# EasyEDA schematic Geiger Counter II_2021-02-28.json
TITLE: Geiger Counter; REV: 1.0; Date: 2021-01-13; Sheet: 1/1; Drawn By: Lawrence Link; Company: LPD
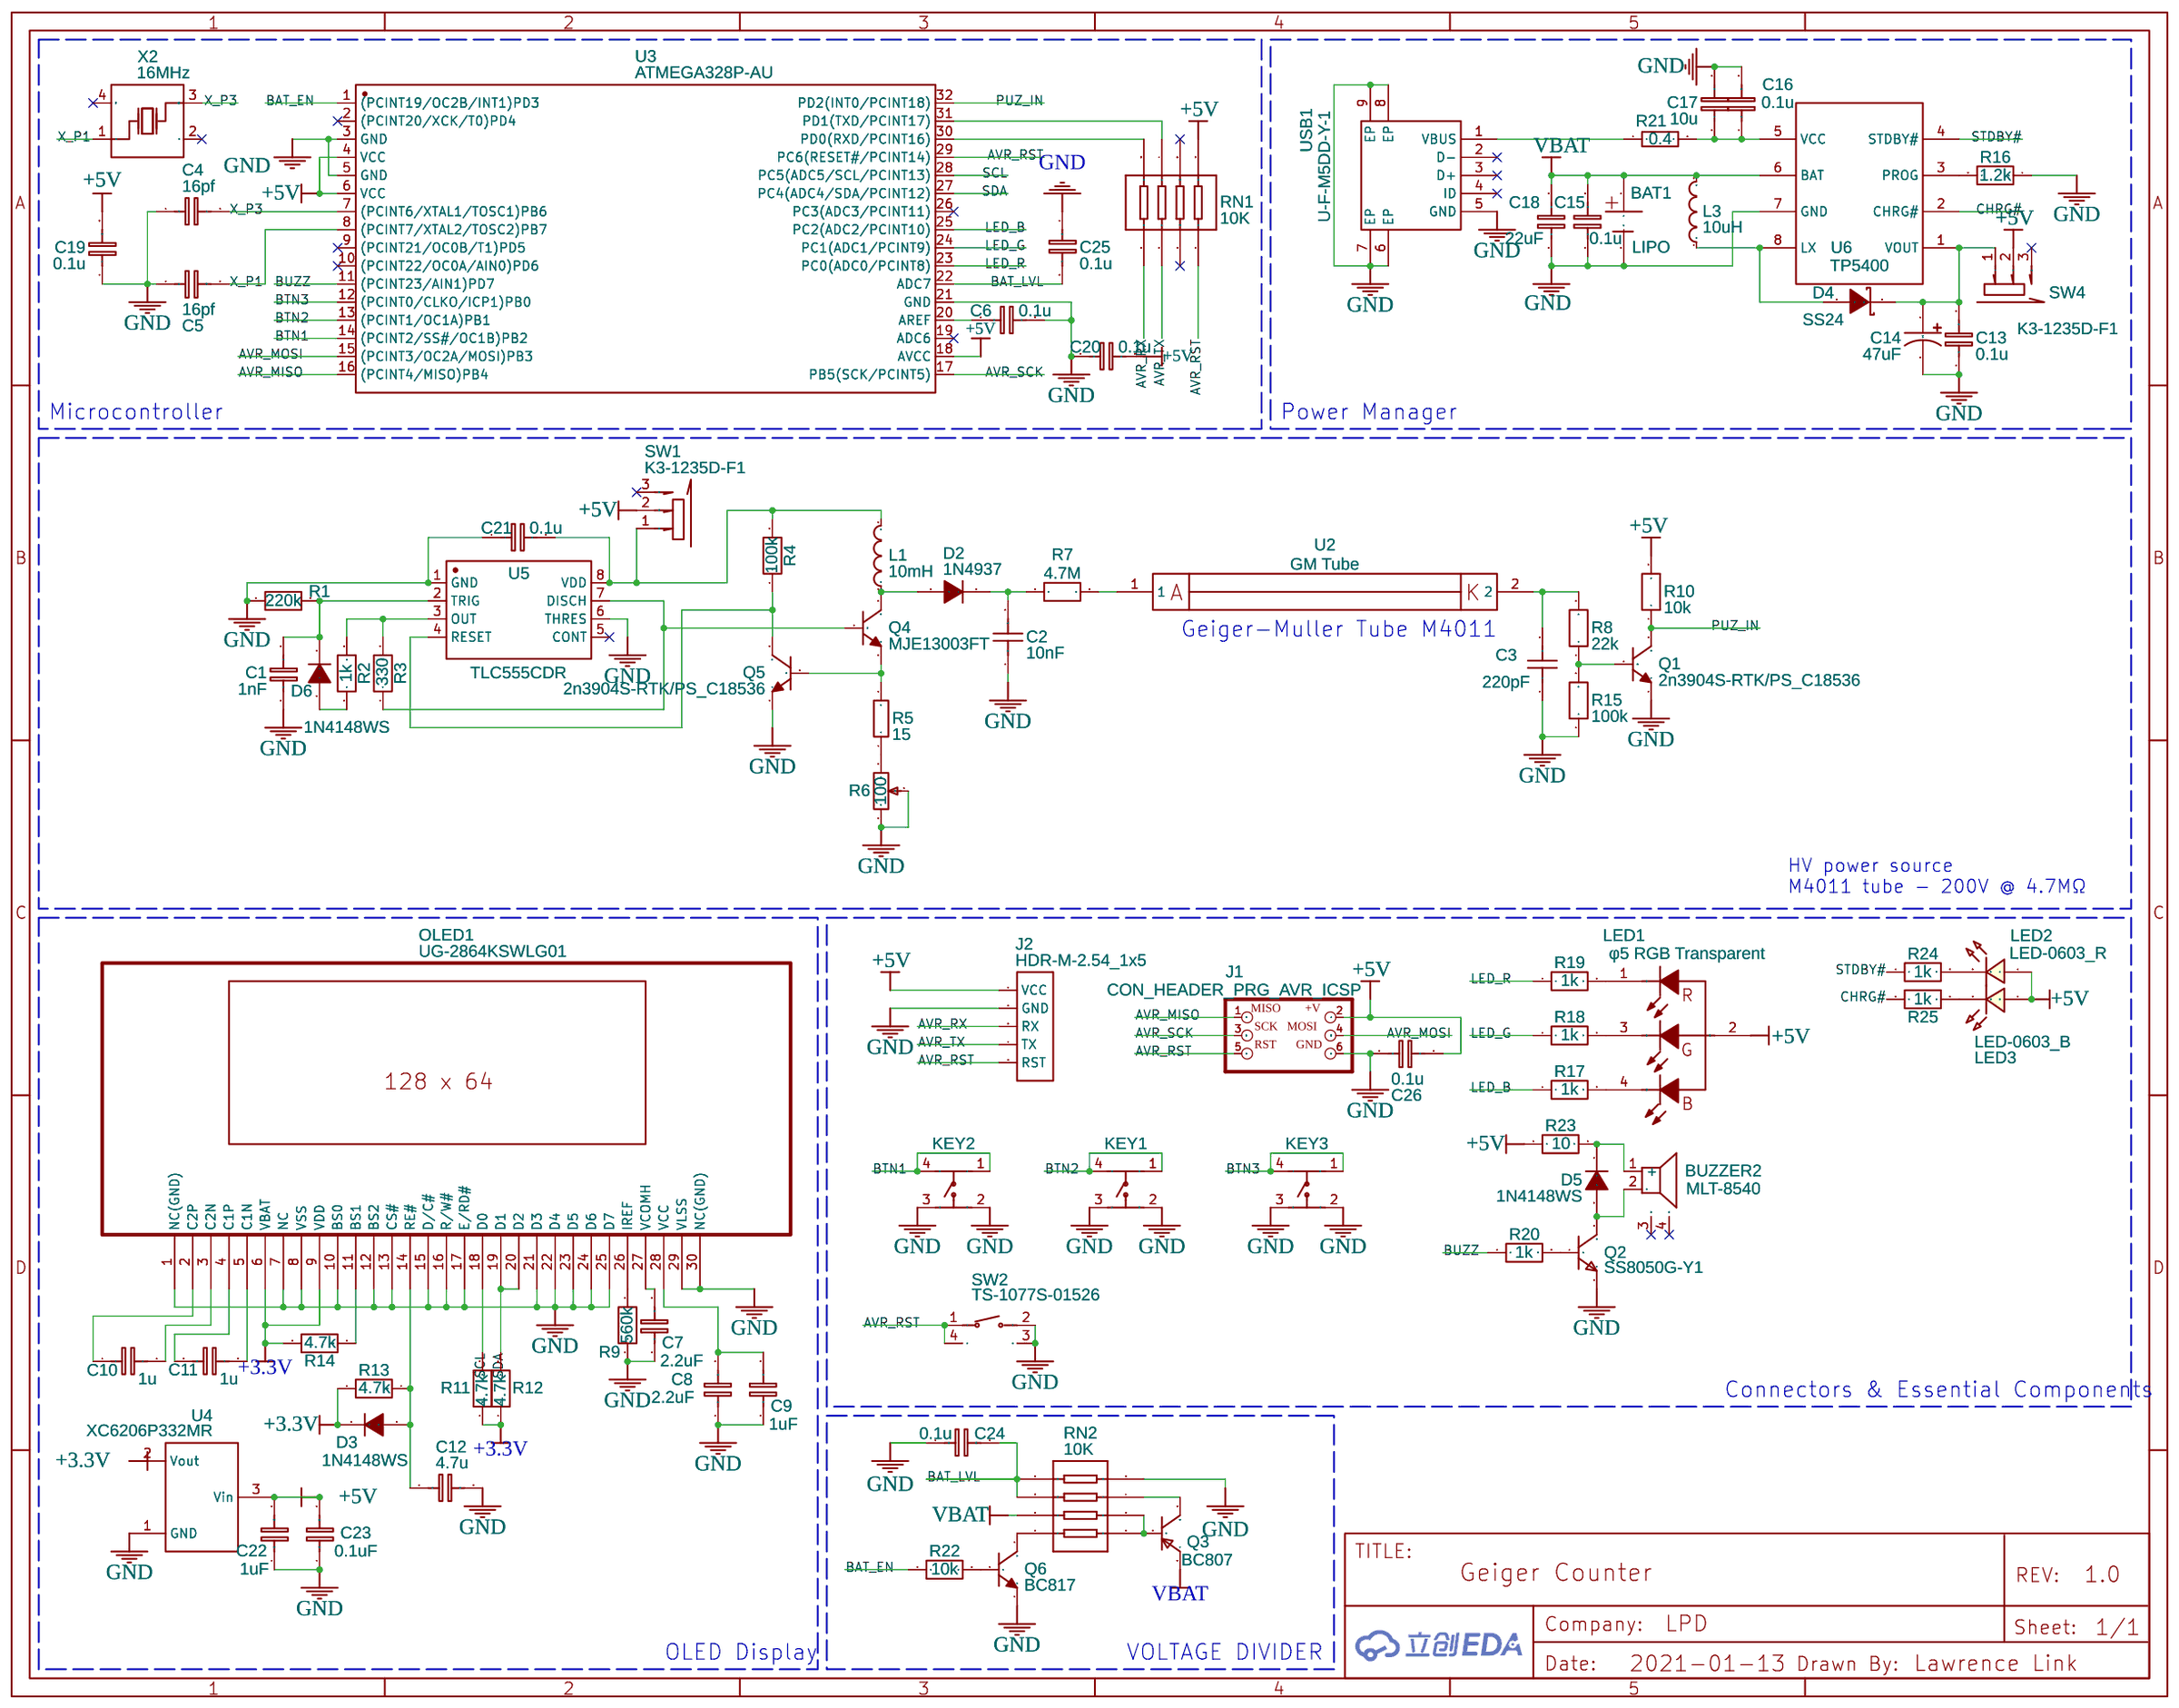
[diagram p0: schematic sheet]

## Parts
BAT1  LIPO  [LITHUM POLYMER 36X20]
BUZZER2  MLT-8540  [BUZ-SMD_4P-L8.5-W8.5-P8.50-BR]
C1  1nF  [C0603]
C2  10nF  [CAP-TH_L9.0-W3.5-P7.50-D1.0]
C3  220pF  [C1812]
C4  16pf  [C0603]
C5  16pf  [C0603]
C6  0.1u  [C0603]
C7  2.2uF  [C0603]
C8  2.2uF  [C0603]
C9  1uF  [C0603]
C10  1u  [C0603]
C11  1u  [C0603]
C12  4.7u  [C0603]
C13  0.1u  [C0603]
C14  47uF  [CAP-SMD_L3.4-W2.8]
C15  0.1u  [C0603]
C16  0.1u  [C0603]
C17  10u  [C0603]
C18  22uF  [C0603]
C19  0.1u  [C0603]
C20  0.1u  [C0603]
C21  0.1u  [C0603]
C22  1uF  [C0603]
C23  0.1uF  [C0603]
C24  0.1u  [C0603]
C25  0.1u  [C0603]
C26  0.1u  [C0603]
D2  1N4937  [DO-41_BD2.4-L4.7-P8.70-D0.9-RD]
D3  1N4148WS  [SOD-323_L1.8-W1.3-LS2.5-RD]
D4  SS24  [SMA_L4.3-W2.6-LS5.2-RD]
D5  1N4148WS  [SOD-323_L1.8-W1.3-LS2.5-RD]
D6  1N4148WS  [SOD-323_L1.8-W1.3-LS2.5-RD]
J1  CON_HEADER_PRG_AVR_ICSP  [HEADER_PRG_2X03]
J2  HDR-M-2.54_1x5  [HDR-M-2.54_1X5]
KEY1  TL3301NF160QG/P010515  [KEY-SMD_4P-L6.0-W6.0-P4.50-LS10.0]
KEY2  TL3301NF160QG/P010515  [KEY-SMD_4P-L6.0-W6.0-P4.50-LS10.0]
KEY3  TL3301NF160QG/P010515  [KEY-SMD_4P-L6.0-W6.0-P4.50-LS10.0]
L1  10mH  [IND-SMD_L6.0-W6.0_FNR60XXS]
L3  10uH  [IND-SMD_L6.0-W6.0]
LED1  φ5 RGB Transparent  [LED-TH_4P-BD5.8-P1.30]
LED2  LED-0603_R  [LED0603_RED]
LED3  LED-0603_B  [LED0603_BLUE]
OLED1  UG-2864KSWLG01  [OLED-1.3]
Q1  2n3904S-RTK/PS_C18536  [SOT-23-3_L2.9-W1.3-P1.90-LS2.4-TR]
Q2  SS8050G-Y1  [SOT-23-3_L2.9-W1.6-P1.90-LS2.8-BR]
Q3  BC807  [SOT-23-3_L2.9-W1.3-P1.90-LS2.4-BR]
Q4  MJE13003FT  [SOT-89-3_L4.5-W2.5-P1.50-LS4.2-BR]
Q5  2n3904S-RTK/PS_C18536  [SOT-23-3_L2.9-W1.3-P1.90-LS2.4-TR]
Q6  BC817  [SOT-23-3_L2.9-W1.3-P1.90-LS2.4-BR]
R1  220k  [R0603]
R2  1k  [R0603]
R3  330  [R0603]
R4  100k  [R0603]
R5  15  [R1206]
R6  100  [RES-ADJ-TH_3P-L9.5-W9.5-P2.54-BR-BS]
R7  4.7M  [R_AXIAL-0.3]
R8  22k  [R0603]
R9  560k  [R0603]
R10  10k  [R0603]
R11  4.7k  [R0603]
R12  4.7k  [R0603]
R13  4.7k  [R0603]
R14  4.7k  [R0603]
R15  100k  [R0603]
R16  1.2k  [R0603]
R17  1k  [R0603]
R18  1k  [R0603]
R19  1k  [R0603]
R20  1k  [R0603]
R21  0.4  [R1206]
R22  10k  [R0603]
R23  10  [R0603]
R24  1k  [R0603]
R25  1k  [R0603]
RN1  10K  [RES-ARRAY-SMD_0603-8P-L3.2-W1.6-BL]
RN2  10K  [RES-ARRAY-SMD_0603-8P-L3.2-W1.6-BL]
SW1  K3-1235D-F1  [SW-TH_K3-1235D-F1]
SW2  TS-1077S-01526  [SW-SMD_L3.1-W3.1-P2.20-LS4.0]
SW4  K3-1235D-F1  [SW-TH_K3-1235D-F1]
U2  GM Tube  [GEIGER TUBE M4011]
U3  ATMEGA328P-AU  [TQFP-32_L7.0-W7.0-P0.80-LS9.0-BL]
U4  XC6206P332MR  [SOT-23-3_L2.9-W1.6-P1.90-LS2.8-BR]
U5  TLC555CDR  [SOIC-8_L5.0-W4.0-P1.27-LS6.0-BL]
U6  TP5400  [SOIC-8_L5.0-W4.0-P1.27-LS6.0-BL-EP]
USB1  U-F-M5DD-Y-1  [MICRO-USB-SMD_U-F-M5DD-Y-1]
X2  16MHz  [OSC-SMD_4P-L3.2-W2.5-BL]

## Library data of the parts
BAT1 = Lithum-Polymer: Manufacturer: Taisko; Supplier: LCSC; Supplier Part: C426276; link: https://item.szlcsc.com/419929.html; Contributor: Qstorey
BUZZER2 = MLT-8540: Supplier: LCSC; Manufacturer: HNDZ; Supplier Part: C95300
C1 C4-C13 C15-C26 = C_0603_EU: Contributor: LCEDA_Lib
C2 = KP103J2J0701: Supplier: LCSC; Supplier Part: C390071; Manufacturer: KYET; Contributor: LCSC; JLCPCB SMD: Yes; SMT Type: Extend
C3 = FM31X221K501ECG: Supplier: LCSC; Supplier Part: C382231; Manufacturer: Prosperity Dielectrics; Contributor: LCSC
C14 = F920J476MBA: Supplier: LCSC; Supplier Part: C389937; Manufacturer: AVX; Contributor: LCSC
D2 = 1N4937: Supplier: LCSC; Supplier Part: C237246; Manufacturer: HL; Contributor: LCSC
D3 D5 D6 = 1N4148WS: Supplier: LCSC; Manufacturer: HT; Contributor: LCSC; Supplier Part: C179718
D4 = SS24: Supplier: LCSC; Manufacturer: MDD; image: //image.lceda.cn/szlcsc/C50645.jpg; Supplier Part: C50645; SMT Type: Extend; JLCPCB SMD: Yes
J1 = CON_HEADER_PRG_AVR_ICSP: Contributor: DangerousPrototype
J2 = HDR-M-2.54_1x5: Supplier Part: C358687; Supplier: LCSC; Contributor: LCEDA_Lib
KEY1-KEY3 = TL3301NF160QG/P010515: Supplier: LCSC; Supplier Part: C273527; Manufacturer: E-Switch; Contributor: LCSC
L1 = FNR6045S103KT: Supplier: LCSC; Manufacturer: cjiang; Contributor: LCSC; Supplier Part: C168108
L3 = CKCS6045-10UH/M: Supplier: LCSC; Supplier Part: C354632; Manufacturer: CENKER; Manufacturer Part: CKCS6045-10uH/M; Contributor: LCSC
LED1 = φ5 RGB Transparent: Supplier: LCSC; Manufacturer: KENTO; Manufacturer Part: φ5 RGB Transparent LED; Contributor: LCSC; Supplier Part: C32985
LED2 = LED-0603_R: Manufacturer: EVERLIGHT(台湾亿光); Manufacturer Part: 19-217/R6C-AL1M2VY/3T; Supplier Part: C72044; Supplier: LCSC; Contributor: LCEDA_01
LED3 = LED-0603_B: Manufacturer: EVERLIGHT(台湾亿光); Manufacturer Part: 19-217/BHC-ZL1M2RY/3T; Supplier Part: C72041; Supplier: LCSC; Contributor: LCEDA_01
OLED1 = UG-2864KSWLG01: Supplier: LCSC; Manufacturer: UG; Supplier Part: C113322
Q1 Q5 = 2n3904S-RTK/PS_C18536: Supplier: LCSC; Manufacturer: KEC; Manufacturer Part: 2n3904S-RTK/PS; image: //image.lceda.cn/szlcsc/C18536.jpg; Supplier Part: C18536; SMT Type: Extend; JLCPCB SMD: Yes
Q2 = SS8050G-Y1: Supplier: LCSC; Supplier Part: C380930; Manufacturer: Galaxy; Contributor: LCSC
Q3 = BC807: Supplier: LCSC; Supplier Part: C466642; Manufacturer: High Diode; Contributor: LCSC
Q4 = MJE13003FT: Supplier: LCSC; Supplier Part: C358520; Manufacturer: Foshan Blue Rocket Elec; Contributor: LCSC
Q6 = BC817: Supplier: LCSC; Manufacturer: CJ; image: //image.lceda.cn/szlcsc/C8589.jpg; Supplier Part: C8589; SMT Type: Extend; JLCPCB SMD: Yes; Paste Type: expand; Assembly Type: smtWeld
R1-R4 R9 R11-R14 R16 R20 R22-R25 = R_0603_EU: Contributor: LCEDA_Lib
R5 = AR06BTDV0150: Supplier: LCSC; Supplier Part: C319834; Manufacturer: Viking Tech; Contributor: LCSC
R6 = 3386P-1-101LF_EU: Supplier: LCSC; Manufacturer: Bochen; Manufacturer Part: 3386P-1-101LF; Supplier Part: C125022
R7 = R_AXIAL-0.3_EU: Contributor: LCEDA_Lib
R8 R10 R15 R17-R19 = R_0805_EU: Contributor: LCEDA_Lib
R21 = 1206W4J040KT5E: Supplier: LCSC; Supplier Part: C620968; Manufacturer: UNI-ROYAL(Uniroyal Elec); Contributor: LCSC
RN1 = CN34JTN102: Supplier: LCSC; Manufacturer: TA-I; Supplier Part: C153136
RN2 = 4D03WGJ0103T5E: Supplier: LCSC; Manufacturer: UniOhm; Supplier Part: C29718; SMT Type: Basic; JLCPCB SMD: Yes; Paste Type: base; Assembly Type: smtWeld
SW1 SW4 = K3-1235D-F1: Supplier: LCSC; Supplier Part: C223839; Manufacturer: Korean Hroparts Elec; Contributor: LCSC
SW2 = TS-1077S-01526: Supplier: LCSC; Supplier Part: C455259; Manufacturer: XUNPU; Contributor: LCSC
U2 = GM Tube: Contributor: Qstorey
U3 = ATMEGA328P-AU: Supplier: LCSC; Manufacturer: MICROCHIP; image: //image.lceda.cn/szlcsc/C14877.jpg; Supplier Part: C14877; SMT Type: Basic; JLCPCB SMD: Yes
U4 = XC6206P332MR: Supplier: LCSC; Manufacturer: TOREX; image: //image.lceda.cn/szlcsc/C5446.jpg; Supplier Part: C5446; SMT Type: Basic; JLCPCB SMD: Yes
U5 = TLC555CDR: Supplier: LCSC; Manufacturer: TI; image: //image.lceda.cn/szlcsc/C6986.jpg; Supplier Part: C6986; SMT Type: Extend; JLCPCB SMD: Yes
U6 = TP5400: Supplier: LCSC; Manufacturer: TOPPOWER; image: //image.lceda.cn/szlcsc/C24154.jpg; Supplier Part: C24154; SMT Type: Extend; JLCPCB SMD: Yes
USB1 = U-F-M5DD-Y-1: Supplier: LCSC; Manufacturer: HRO; Supplier Part: C91467
X2 = SMD-3225_4P 16MHz 20pF 10ppm -40&#126;+85℃: Supplier: LCSC; Supplier Part: C164049; Manufacturer: Zhejiang Abel Elec; Contributor: LCSC; SMT Type: Extend; JLCPCB SMD: Yes

## Nets
+3.3V: D3.1(K) OLED1.6(VBAT) OLED1.9(VDD) R11.1 R12.1 R13.2 R14.1 U4.2(Vout)
+5V: C19.2 C20.2 C22.2 C23.2 C26.2 J1.2(+V) J2.1(VCC) LED1.2(CA) LED2.1 LED3.1 R10.2 R23.1 RN1.5 SW1.2 SW4.2 U3.4(VCC) U3.6(VCC) U3.18(AVCC) U4.3(Vin)
GND: BAT1.2 C1.1 C2.1 C3.1 C4.1 C5.1 C6.2 C7.1 C8.1 C9.1 C12.2 C13.1 C14.2 C15.1 C16.2 C17.2 C18.1 C19.1 C20.1 C21.1 C22.1 C23.1 C24.1 C25.1 C26.1 J1.6(GND) J2.2(GND) KEY1.2 KEY1.3(1) KEY2.2 KEY2.3(1) KEY3.2 KEY3.3(1) OLED1.1(NC(GND)) OLED1.7(NC) OLED1.8(VSS) OLED1.10(BS0) OLED1.12(BS2) OLED1.13(CS#) OLED1.15(D/C#) OLED1.16(R/W#) OLED1.17(E/RD#) OLED1.21(D3) OLED1.22(D4) OLED1.23(D5) OLED1.24(D6) OLED1.25(D7) OLED1.29(VLSS) OLED1.30(NC(GND)) Q1.1(E) Q2.2(E) Q5.1(E) Q6.2(E) R1.2 R6.2 R6.3 R9.1 R15.1 R16.1 RN2.8 SW2.2 SW2.3 U3.3(GND) U3.5(GND) U3.21(GND) U4.1(GND) U5.1(GND) U5.6(THRES) U6.7(GND) USB1.5(GND) USB1.6(EP) USB1.7(EP) USB1.8(EP) USB1.9(EP)
VBAT: BAT1.1 C15.2 C18.2 L3.2 Q3.2(E) RN2.3 U6.6(BAT)
AVR_MISO: J1.1(MISO) U3.16((PCINT4/MISO)PB4)
AVR_MOSI: J1.4(MOSI) U3.15((PCINT3/OC2A/MOSI)PB3)
AVR_RST: J1.5(RST) J2.5(RST) RN1.4 SW2.1 SW2.4 U3.29(PC6(RESET#/PCINT14))
AVR_RX: J2.3(RX) RN1.1
AVR_SCK: J1.3(SCK) U3.17(PB5(SCK/PCINT5))
AVR_TX: J2.4(TX) RN1.2
BAT_EN: R22.1 U3.1((PCINT19/OC2B/INT1)PD3)
BAT_LVL: C24.2 C25.2 RN2.1 RN2.2 U3.22(ADC7)
BTN1: KEY2.1(3) KEY2.4 U3.14((PCINT2/SS#/OC1B)PB2)
BTN2: KEY1.1(3) KEY1.4 U3.13((PCINT1/OC1A)PB1)
BTN3: KEY3.1(3) KEY3.4 U3.12((PCINT0/CLKO/ICP1)PB0)
BUZZ: R20.1 U3.11((PCINT23/AIN1)PD7)
CHRG#: R25.1 U6.2(CHRG#)
LED_B: R17.1 U3.25(PC2(ADC2/PCINT10))
LED_G: R18.1 U3.24(PC1(ADC1/PCINT9))
LED_R: R19.1 U3.23(PC0(ADC0/PCINT8))
PUZ_IN: Q1.3(C) R10.1 U3.32(PD2(INT0/PCINT18))
SCL: OLED1.18(D0) R11.2 U3.28(PC5(ADC5/SCL/PCINT13))
SDA: OLED1.19(D1) OLED1.20(D2) R12.2 U3.27(PC4(ADC4/SDA/PCINT12))
STDBY#: R24.1 U6.4(STDBY#)
X_P1: C5.2 U3.8((PCINT7/XTAL2/TOSC2)PB7) X2.1(OSC1)
X_P3: C4.2 U3.7((PCINT6/XTAL1/TOSC1)PB6) X2.3(OSC2)
Net-(BUZZER2-1): BUZZER2.1(+) D5.1(K) R23.2
Net-(BUZZER2-2): BUZZER2.2 D5.2(A) Q2.3(C)
Net-(C1-2): C1.2 D6.1(K) R1.1 U5.2(TRIG)
Net-(C2-2): C2.2 D2.1(K) R7.1
Net-(C3-2): C3.2 R8.2 U2.2
Net-(C6-1): C6.1 U3.20(AREF)
Net-(C7-2): C7.2 OLED1.27(VCOMH)
Net-(C8-2): C8.2 C9.2 OLED1.28(VCC)
Net-(C10-1): C10.1 OLED1.2(C2P)
Net-(C10-2): C10.2 OLED1.3(C2N)
Net-(C11-1): C11.1 OLED1.4(C1P)
Net-(C11-2): C11.2 OLED1.5(C1N)
Net-(C12-1): C12.1 D3.2(A) OLED1.14(RE#) R13.1
Net-(C13-2): C13.2 C14.1 D4.1(K) SW4.1 U6.1(VOUT)
Net-(C16-1): C16.1 C17.1 R21.2 U6.5(VCC)
Net-(C21-2): C21.2 L1.2 R4.2 SW1.1 U5.8(VDD)
Net-(D2-2): D2.2(A) L1.1 Q4.2(C)
Net-(D4-2): D4.2(A) L3.1 U6.8(LX)
Net-(D6-2): D6.2(A) R2.1
Net-(LED1-1): LED1.1(KR) R19.2
Net-(LED1-3): LED1.3(KG) R18.2
Net-(LED1-4): LED1.4(KB) R17.2
Net-(LED2-2): LED2.2 R24.2
Net-(LED3-2): LED3.2 R25.2
Net-(OLED1-11): OLED1.11(BS1) R14.2
Net-(OLED1-26): OLED1.26(IREF) R9.2
Net-(Q1-2): Q1.2(B) R8.1 R15.2
Net-(Q2-1): Q2.1(B) R20.2
Net-(Q3-1): Q3.1(B) RN2.5 RN2.6
Net-(Q3-3): Q3.3(C) RN2.7
Net-(Q4-1): Q4.1(B) R3.1 U5.7(DISCH)
Net-(Q4-3): Q4.3(E) Q5.2(B) R5.2
Net-(Q5-3): Q5.3(C) R4.1 U5.4(RESET)
Net-(Q6-1): Q6.1(B) R22.2
Net-(Q6-3): Q6.3(C) RN2.4
Net-(R2-2): R2.2 R3.2 U5.3(OUT)
Net-(R5-1): R5.1 R6.1
Net-(R7-2): R7.2 U2.1
Net-(R16-2): R16.2 U6.3(PROG)
Net-(R21-1): R21.1 USB1.1(VBUS)
Net-(RN1-7): RN1.7 U3.31(PD1(TXD/PCINT17))
Net-(RN1-8): RN1.8 U3.30(PD0(RXD/PCINT16))

Not connected (* = marked no-connect by the designer): BUZZER2 3(NC)* 4(NC)*; RN1 3* 6*; SW1 3*; SW4 3*; U3 2((PCINT20/XCK/T0)PD4)* 9((PCINT21/OC0B/T1)PD5)* 10((PCINT22/OC0A/AIN0)PD6)* 19(ADC6)* 26(PC3(ADC3/PCINT11))*; U5 5(CONT)*; USB1 2(D-)* 3(D+)* 4(ID)*; X2 2(GND)* 4(GND)*

## Notes on the sheet
- Microcontroller
- Power Manager
- Geiger-Muller Tube M4011
- HV power source
  M4011 tube - 200V @ 4.7MΩ
- Connectors & Essential Components
- OLED Display
- VOLTAGE DIVIDER
